# Altium schematic sheet AK4637EN.SchDoc
size A4
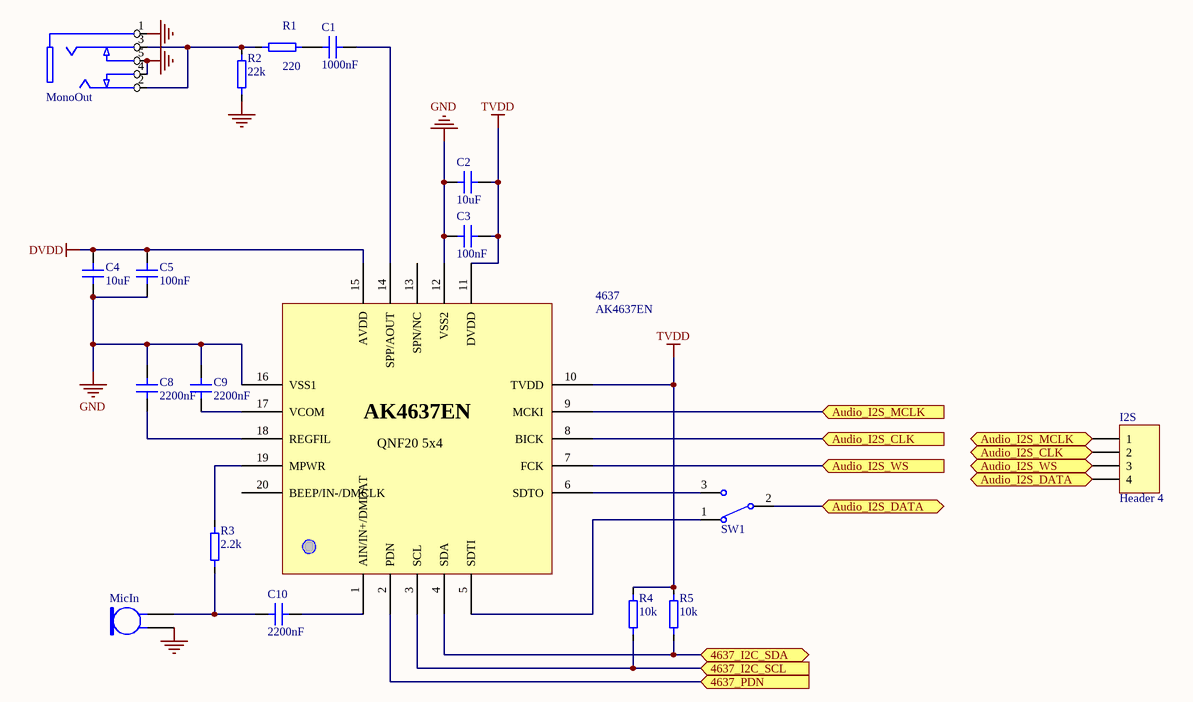
[diagram p0: AK4637EN.SchDoc]

## Parts
4637  AK4637EN  [AK4637EN]
C1  value 1000nF  [SMD 0603]  (hidden comment: Cap SMD)
C2  value 10uF  [SMD 0805]  (hidden comment: Cap SMD)
C3  value 100nF  [SMD 0603]  (hidden comment: Cap SMD)
C4  value 10uF  [SMD 0805]  (hidden comment: Cap SMD)
C5  value 100nF  [SMD 0603]  (hidden comment: Cap SMD)
C8  value 2200nF  [SMD 0603]  (hidden comment: Cap SMD)
C9  value 2200nF  [SMD 0603]  (hidden comment: Cap SMD)
C10  value 2200nF  [SMD 0603]  (hidden comment: Cap SMD)
I2S  Header 4  [HDR1X4]
MicIn  Mic2  [PIN2]  (value not drawn)
MonoOut  Audio Jack PJ-328  [Audio Jack PJ-328]  (value not drawn)
R1  value 220  [SMD 0603]  (hidden comment: RES SMD)
R2  value 22k  [SMD 0603]  (hidden comment: RES SMD)
R3  value 2.2k  [SMD 0603]  (hidden comment: RES SMD)
R4  value 10k  [SMD 0603]  (hidden comment: RES SMD)
R5  value 10k  [SMD 0603]  (hidden comment: RES SMD)
SW1  Switch_1  [Switch 2P2T]  (value not drawn)

## Ports
4637_I2C_SCL (in), 4637_I2C_SDA (bidir), 4637_PDN (in), Audio_I2S_CLK, Audio_I2S_CLK (in), Audio_I2S_DATA, Audio_I2S_DATA (bidir), Audio_I2S_MCLK, Audio_I2S_MCLK (in), Audio_I2S_WS, Audio_I2S_WS (in)

## Nets
DVDD: 4637.15(AVDD) C4.2 C5.2
GND: 4637.12(VSS2) 4637.16(VSS1) C2.1 C3.1 C4.1 C5.1 C8.2 C9.2 MicIn.1 MonoOut.1(GND) MonoOut.4(RIGHT_SW) MonoOut.5(LEFT_SW) R2.1
TVDD: 4637.10(TVDD) 4637.11(DVDD) C2.2 C3.2 R4.2 R5.2
4637_I2C_SCL: 4637.3(SCL) R4.1 ; port 4637_I2C_SCL
4637_I2C_SDA: 4637.4(SDA) R5.1 ; port 4637_I2C_SDA
4637_PDN: 4637.2(PDN) ; port 4637_PDN
Audio_I2S_CLK: 4637.8(BICK) I2S.2 ; port Audio_I2S_CLK
Audio_I2S_DATA: I2S.4 SW1.2 ; port Audio_I2S_DATA
Audio_I2S_MCLK: 4637.9(MCKI) I2S.1 ; port Audio_I2S_MCLK
Audio_I2S_WS: 4637.7(FCK) I2S.3 ; port Audio_I2S_WS
Net4637_1: 4637.1(AIN/IN+/DMDAT) C10.2
Net4637_5: 4637.5(SDTI) SW1.1
Net4637_6: 4637.6(SDTO) SW1.3
Net4637_14: 4637.14(SPP/AOUT) C1.2
Net4637_17: 4637.17(VCOM) C9.1
Net4637_18: 4637.18(REGFIL) C8.1
Net4637_19: 4637.19(MPWR) R3.2
NetC1_1: C1.1 R1.2
NetC10_1: C10.1 MicIn.2 R3.1
NetMonoOut_2: MonoOut.2(RIGHT) MonoOut.3(LEFT) R1.1 R2.2

Not connected (* = marked no-connect by the designer): 4637 13(SPN/NC) 20(BEEP/IN-/DMCLK)

## Notes on the sheet
- (in symbol AK4637EN) QNF20 5x4

## Library data of the parts
4637 = AK4637EN: Value: U?
C1-C5 C8-C10 = Capicity SMD
I2S = Header 4: Header, 4-Pin; LatestRevisionDate: 17-Jul-2002; LatestRevisionNote: Re-released for DXP Platform.; Publisher: Altium Limited
MicIn = Mic2: Microphone; Published: 24-Mar-1999; LatestRevisionDate: 17-Jul-2002; LatestRevisionNote: Re-released for DXP Platform.; PackageReference: PIN2; Publisher: Altium Limited
R1-R5 = Resistor SMD